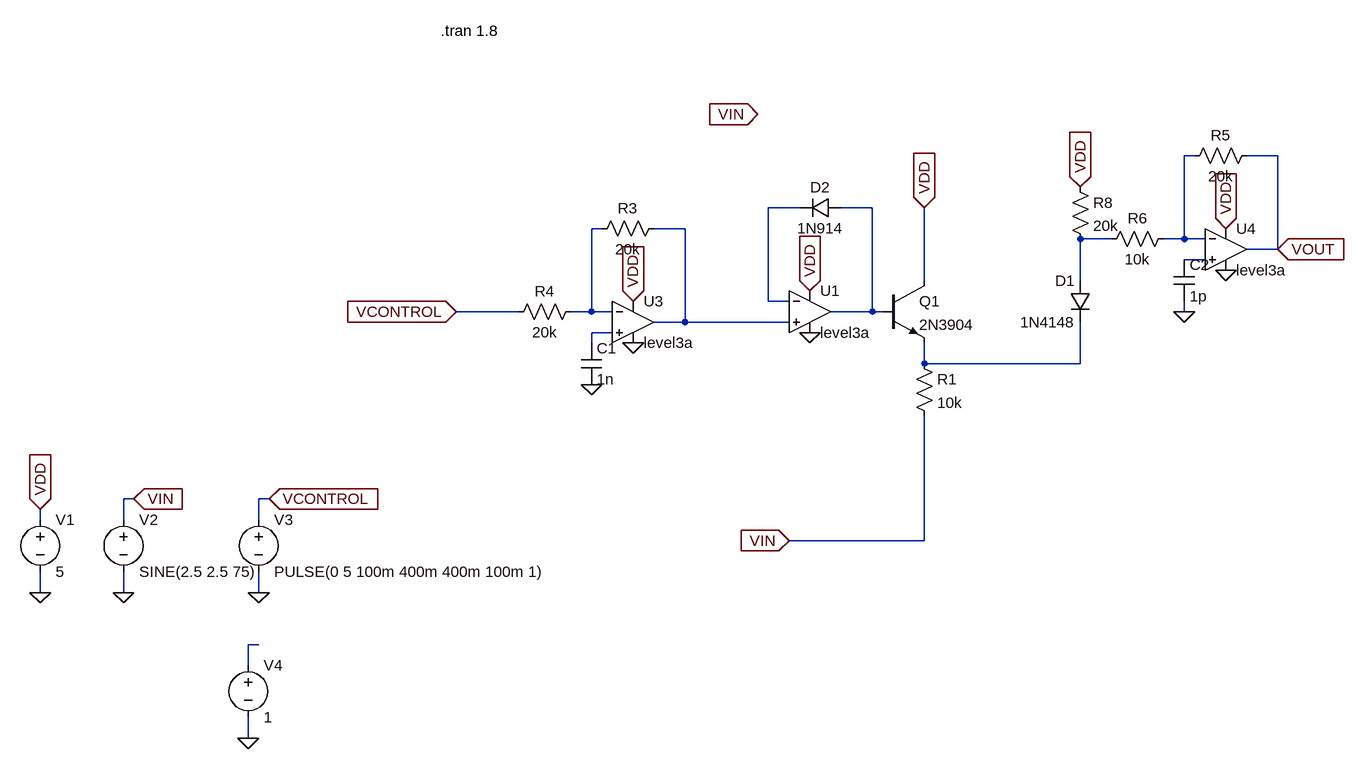
[diagram p0: schematic VCA.asc]
VCA.asc, the LTspice schematic file:
Version 4
SHEET 1 2068 936
WIRE 944 -304 928 -304
WIRE 1072 -304 1024 -304
WIRE 336 -224 288 -224
WIRE 448 -224 400 -224
WIRE 32 -192 16 -192
WIRE 160 -192 112 -192
WIRE 816 -176 768 -176
WIRE 928 -176 928 -304
WIRE 928 -176 896 -176
WIRE 960 -176 928 -176
WIRE 1072 -160 1072 -304
WIRE 1072 -160 1024 -160
WIRE 960 -144 928 -144
WIRE 528 -112 528 -224
WIRE 768 -112 768 -176
WIRE 288 -80 288 -224
WIRE 320 -80 288 -80
WIRE -96 -64 -192 -64
WIRE 16 -64 16 -192
WIRE 16 -64 -16 -64
WIRE 48 -64 16 -64
WIRE 448 -64 448 -224
WIRE 448 -64 384 -64
WIRE 464 -64 448 -64
WIRE 928 -64 928 -80
WIRE 160 -48 160 -192
WIRE 160 -48 112 -48
WIRE 320 -48 160 -48
WIRE 48 -32 16 -32
WIRE 16 -16 16 -32
WIRE 528 16 528 -16
WIRE 768 16 768 -48
WIRE 768 16 528 16
WIRE -688 224 -704 224
WIRE -480 224 -496 224
WIRE -832 256 -832 240
WIRE -704 256 -704 224
WIRE -496 256 -496 224
WIRE 528 288 528 96
WIRE 528 288 320 288
WIRE -832 368 -832 336
WIRE -704 368 -704 336
WIRE -496 368 -496 336
WIRE -496 448 -512 448
WIRE -512 480 -512 448
WIRE -512 592 -512 560
FLAG -496 368 0
FLAG -688 224 VIN
IOPIN -688 224 In
FLAG -192 -64 VCONTROL
IOPIN -192 -64 In
FLAG -704 368 0
FLAG 272 -368 VIN
IOPIN 272 -368 In
FLAG 352 -96 VDD
IOPIN 352 -96 In
FLAG 352 -32 0
FLAG -832 240 VDD
IOPIN -832 240 In
FLAG -832 368 0
FLAG 528 -224 VDD
IOPIN 528 -224 In
FLAG 320 288 VIN
IOPIN 320 288 In
FLAG 80 -80 VDD
IOPIN 80 -80 In
FLAG 80 -16 0
FLAG 992 -192 VDD
IOPIN 992 -192 In
FLAG 992 -128 0
FLAG 928 -64 0
FLAG 768 -256 VDD
IOPIN 768 -256 In
FLAG 16 48 0
FLAG 1072 -160 VOUT
IOPIN 1072 -160 In
FLAG -512 592 0
FLAG -480 224 VCONTROL
IOPIN -480 224 In
SYMBOL voltage -496 240 R0
WINDOW 123 0 0 Left 0
WINDOW 39 0 0 Left 0
SYMATTR InstName V3
SYMATTR Value PULSE(0 5 100m 400m 400m 100m 1)
SYMBOL voltage -704 240 R0
WINDOW 123 0 0 Left 0
WINDOW 39 0 0 Left 0
SYMATTR InstName V2
SYMATTR Value SINE(2.5 2.5 75)
SYMBOL voltage -832 240 R0
WINDOW 123 0 0 Left 0
WINDOW 39 0 0 Left 0
SYMATTR InstName V1
SYMATTR Value 5
SYMBOL OpAmps\\UniversalOpAmp3 352 -64 R0
SYMATTR InstName U1
SYMBOL OpAmps\\UniversalOpAmp3 80 -48 R0
SYMATTR InstName U3
SYMBOL res 128 -208 R90
WINDOW 0 0 56 VBottom 2
WINDOW 3 32 56 VTop 2
SYMATTR InstName R3
SYMATTR Value 20k
SYMBOL res 0 -80 R90
WINDOW 0 0 56 VBottom 2
WINDOW 3 32 56 VTop 2
SYMATTR InstName R4
SYMATTR Value 20k
SYMBOL OpAmps\\UniversalOpAmp3 992 -160 R0
SYMATTR InstName U4
SYMBOL cap 912 -144 R0
SYMATTR InstName C2
SYMATTR Value 1p
SYMBOL res 1040 -320 R90
WINDOW 0 0 56 VBottom 2
WINDOW 3 32 56 VTop 2
SYMATTR InstName R5
SYMATTR Value 20k
SYMBOL res 912 -192 R90
WINDOW 0 0 56 VBottom 2
WINDOW 3 32 56 VTop 2
SYMATTR InstName R6
SYMATTR Value 10k
SYMBOL res 752 -272 R0
SYMATTR InstName R8
SYMATTR Value 20k
SYMBOL npn 464 -112 R0
SYMATTR InstName Q1
SYMATTR Value 2N3904
SYMBOL cap 0 -16 R0
SYMATTR InstName C1
SYMATTR Value 1n
SYMBOL res 512 0 R0
SYMATTR InstName R1
SYMATTR Value 10k
SYMBOL diode 784 -112 M0
SYMATTR InstName D1
SYMATTR Value 1N4148
SYMBOL voltage -512 464 R0
WINDOW 123 0 0 Left 0
WINDOW 39 0 0 Left 0
SYMATTR InstName V4
SYMATTR Value 1
SYMBOL diode 400 -240 R90
WINDOW 0 0 32 VBottom 2
WINDOW 3 32 32 VTop 2
SYMATTR InstName D2
SYMATTR Value 1N914
TEXT -216 -496 Left 2 !.tran 1.8

The netlist it stands for:
* VCA.asc
V3 VCONTROL 0 PULSE(0 5 100m 400m 400m 100m 1)
V2 VIN 0 SINE(2.5 2.5 75)
V1 VDD 0 5
XU1 N005 N002 VDD 0 N003 level3a  ; pins In+ In- V+ V- OUT
XU3 N008 N004 VDD 0 N005 level3a  ; pins In+ In- V+ V- OUT
R3 N005 N004 20k
R4 N004 VCONTROL 20k
XU4 N007 N001 VDD 0 VOUT level3a  ; pins In+ In- V+ V- OUT
C2 N007 0 1p
R5 VOUT N001 20k
R6 N001 N006 10k
R8 VDD N006 20k
Q1 VDD N003 N009 0 2N3904
C1 N008 0 1n
R1 N009 VIN 10k
D1 N006 N009 1N4148
V4 N010 0 1
D2 N003 N002 1N914
.model D D
.lib standard.dio
.model NPN NPN
.model PNP PNP
.lib standard.bjt
.tran 1.8
.backanno
.end